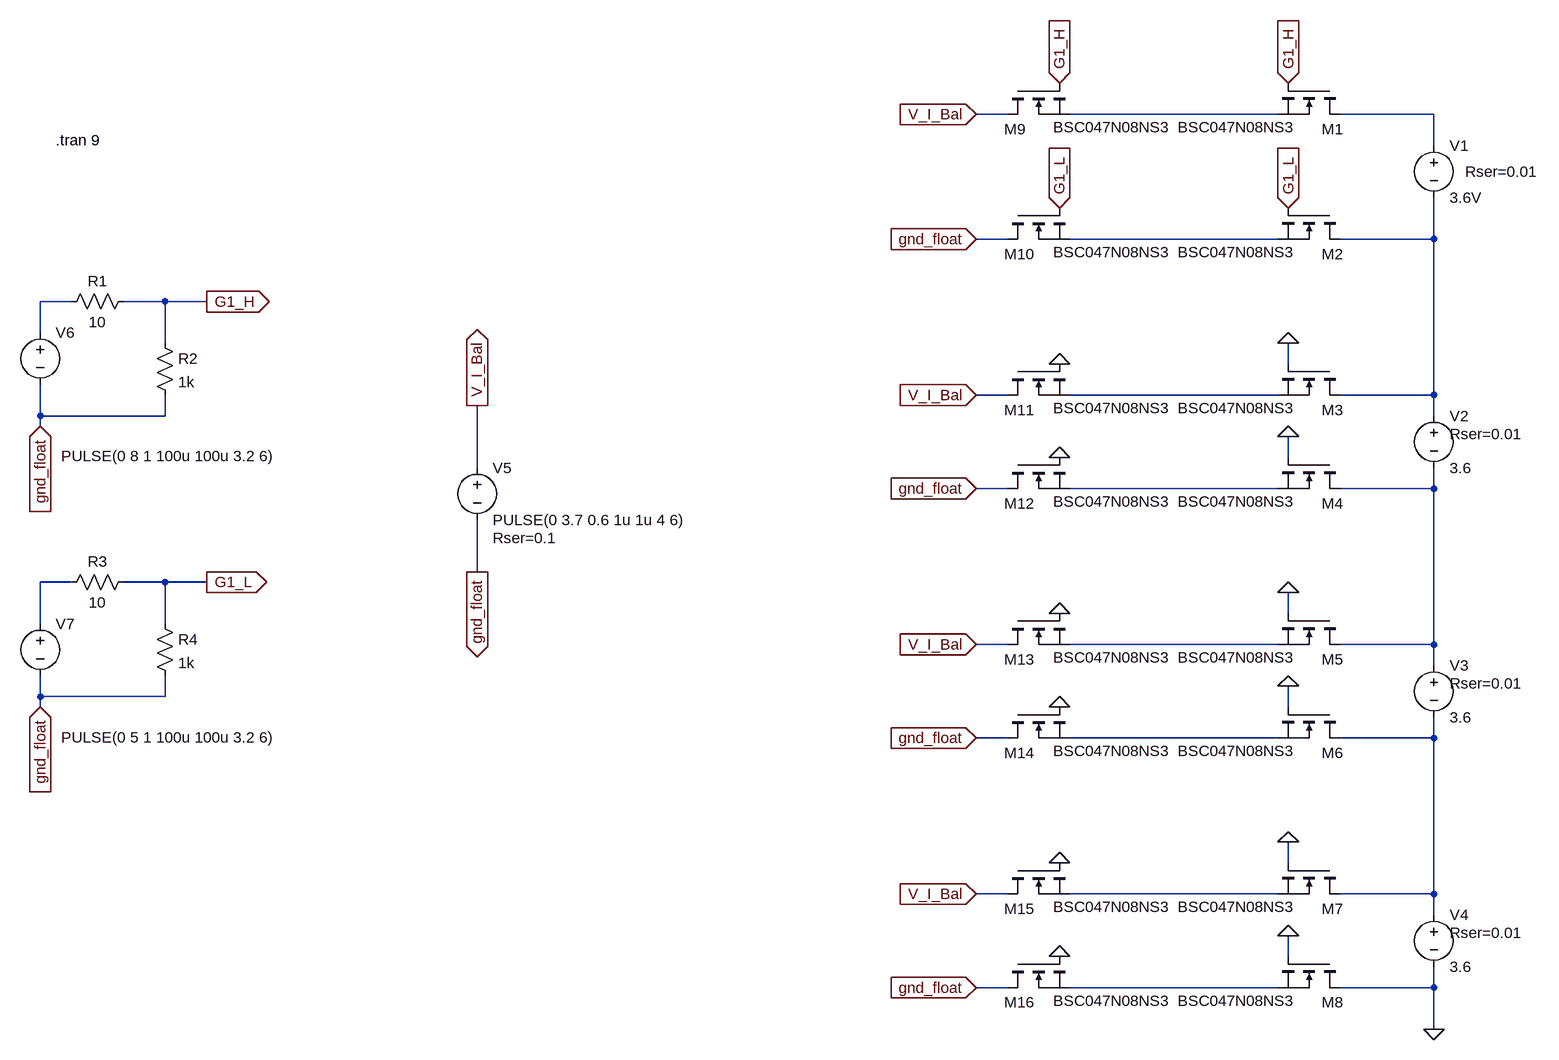
[diagram p0: schematic Simulation_Einzelmosfets.asc]
Simulation_Einzelmosfets.asc, the LTspice schematic file:
Version 4.1
SHEET 1 1152 1188
WIRE -224 -240 -272 -240
WIRE 192 -240 -128 -240
WIRE 432 -240 288 -240
WIRE 432 -192 432 -240
WIRE -224 -48 -272 -48
WIRE 192 -48 -128 -48
WIRE 432 -48 432 -112
WIRE 432 -48 288 -48
WIRE -1664 48 -1712 48
WIRE -1520 48 -1584 48
WIRE -1456 48 -1520 48
WIRE -1712 96 -1712 48
WIRE -1520 112 -1520 48
WIRE 208 144 208 112
WIRE -224 192 -272 192
WIRE 192 192 -128 192
WIRE 432 192 432 -48
WIRE 432 192 288 192
WIRE -1712 224 -1712 176
WIRE -1520 224 -1520 192
WIRE -1520 224 -1712 224
WIRE 432 224 432 192
WIRE -1712 240 -1712 224
WIRE 208 288 208 256
WIRE -1040 304 -1040 208
WIRE -224 336 -272 336
WIRE 192 336 -128 336
WIRE 432 336 432 304
WIRE 432 336 288 336
WIRE -1040 464 -1040 384
WIRE -1664 480 -1712 480
WIRE -1520 480 -1584 480
WIRE -1456 480 -1520 480
WIRE 208 528 208 496
WIRE -1712 544 -1712 480
WIRE -1520 544 -1520 480
WIRE -224 576 -272 576
WIRE 192 576 -128 576
WIRE 432 576 432 336
WIRE 432 576 288 576
WIRE 432 608 432 576
WIRE -1712 656 -1712 624
WIRE -1520 656 -1520 624
WIRE -1520 656 -1712 656
WIRE -1712 672 -1712 656
WIRE 208 672 208 640
WIRE -224 720 -272 720
WIRE 192 720 -128 720
WIRE 432 720 432 688
WIRE 432 720 288 720
WIRE 208 912 208 880
WIRE -224 960 -272 960
WIRE 192 960 -128 960
WIRE 432 960 432 720
WIRE 432 960 288 960
WIRE 432 992 432 960
WIRE 208 1056 208 1024
WIRE -224 1104 -272 1104
WIRE 192 1104 -128 1104
WIRE 432 1104 432 1072
WIRE 432 1104 288 1104
WIRE 432 1168 432 1104
FLAG 432 1168 0
FLAG -1040 208 V_I_Bal
IOPIN -1040 208 Out
FLAG -1040 464 gnd_float
IOPIN -1040 464 Out
FLAG -272 -240 V_I_Bal
IOPIN -272 -240 In
FLAG -272 -48 gnd_float
IOPIN -272 -48 In
FLAG -1456 48 G1_H
IOPIN -1456 48 Out
FLAG -1456 480 G1_L
IOPIN -1456 480 Out
FLAG 208 112 0
FLAG 208 256 0
FLAG 208 496 0
FLAG 208 640 0
FLAG 208 880 0
FLAG 208 1024 0
FLAG -144 -288 G1_H
IOPIN -144 -288 In
FLAG -144 -96 G1_L
IOPIN -144 -96 In
FLAG -144 144 0
FLAG -144 288 0
FLAG -144 528 0
FLAG -144 672 0
FLAG -144 912 0
FLAG -144 1056 0
FLAG -272 336 gnd_float
IOPIN -272 336 In
FLAG -272 720 gnd_float
IOPIN -272 720 In
FLAG -272 1104 gnd_float
IOPIN -272 1104 In
FLAG -1712 240 gnd_float
IOPIN -1712 240 In
FLAG -1712 672 gnd_float
IOPIN -1712 672 In
FLAG -272 192 V_I_Bal
IOPIN -272 192 In
FLAG -272 576 V_I_Bal
IOPIN -272 576 In
FLAG -272 960 V_I_Bal
IOPIN -272 960 In
FLAG 208 -288 G1_H
IOPIN 208 -288 In
FLAG 208 -96 G1_L
IOPIN 208 -96 In
SYMBOL nmos 288 -288 R90
WINDOW 0 71 -5 VRight 2
WINDOW 3 68 70 VRight 2
SYMATTR InstName M1
SYMATTR Value BSC047N08NS3
SYMBOL nmos 288 -96 R90
WINDOW 0 71 -5 VRight 2
WINDOW 3 68 70 VRight 2
SYMATTR InstName M2
SYMATTR Value BSC047N08NS3
SYMBOL nmos 288 144 R90
WINDOW 0 71 -5 VRight 2
WINDOW 3 68 70 VRight 2
SYMATTR InstName M3
SYMATTR Value BSC047N08NS3
SYMBOL nmos 288 288 R90
WINDOW 0 71 -5 VRight 2
WINDOW 3 68 70 VRight 2
SYMATTR InstName M4
SYMATTR Value BSC047N08NS3
SYMBOL voltage 432 -208 R0
WINDOW 123 0 0 Left 0
WINDOW 39 48 56 Left 2
SYMATTR SpiceLine Rser=0.01
SYMATTR InstName V1
SYMATTR Value 3.6V
SYMBOL voltage 432 208 R0
WINDOW 123 0 0 Left 0
WINDOW 39 24 44 Left 2
SYMATTR SpiceLine Rser=0.01
SYMATTR InstName V2
SYMATTR Value 3.6
SYMBOL nmos 288 528 R90
WINDOW 0 71 -5 VRight 2
WINDOW 3 68 70 VRight 2
SYMATTR InstName M5
SYMATTR Value BSC047N08NS3
SYMBOL nmos 288 672 R90
WINDOW 0 71 -5 VRight 2
WINDOW 3 68 70 VRight 2
SYMATTR InstName M6
SYMATTR Value BSC047N08NS3
SYMBOL voltage 432 592 R0
WINDOW 123 0 0 Left 0
WINDOW 39 24 44 Left 2
SYMATTR SpiceLine Rser=0.01
SYMATTR InstName V3
SYMATTR Value 3.6
SYMBOL nmos 288 912 R90
WINDOW 0 71 -5 VRight 2
WINDOW 3 68 70 VRight 2
SYMATTR InstName M7
SYMATTR Value BSC047N08NS3
SYMBOL nmos 288 1056 R90
WINDOW 0 71 -5 VRight 2
WINDOW 3 68 70 VRight 2
SYMATTR InstName M8
SYMATTR Value BSC047N08NS3
SYMBOL voltage 432 976 R0
WINDOW 123 0 0 Left 0
WINDOW 39 24 44 Left 2
SYMATTR SpiceLine Rser=0.01
SYMATTR InstName V4
SYMATTR Value 3.6
SYMBOL voltage -1040 288 R0
WINDOW 123 0 0 Left 0
WINDOW 39 24 124 Left 2
SYMATTR SpiceLine Rser=0.1
SYMATTR InstName V5
SYMATTR Value PULSE(0 3.7 0.6 1u 1u 4 6)
SYMBOL voltage -1712 80 R0
WINDOW 3 32 206 Left 2
WINDOW 123 0 0 Left 0
WINDOW 39 0 0 Left 0
SYMATTR Value PULSE(0 8 1 100u 100u 3.2 6)
SYMATTR InstName V6
SYMBOL res -1568 32 R90
WINDOW 0 0 56 VBottom 2
WINDOW 3 32 56 VTop 2
SYMATTR InstName R1
SYMATTR Value 10
SYMBOL res -1536 96 R0
SYMATTR InstName R2
SYMATTR Value 1k
SYMBOL voltage -1712 528 R0
WINDOW 3 32 191 Left 2
WINDOW 123 0 0 Left 0
WINDOW 39 0 0 Left 0
SYMATTR Value PULSE(0 5 1 100u 100u 3.2 6)
SYMATTR InstName V7
SYMBOL res -1568 464 R90
WINDOW 0 0 56 VBottom 2
WINDOW 3 32 56 VTop 2
SYMATTR InstName R3
SYMATTR Value 10
SYMBOL res -1536 528 R0
SYMATTR InstName R4
SYMATTR Value 1k
SYMBOL nmos -224 -288 M90
WINDOW 0 71 -5 VRight 2
WINDOW 3 68 70 VRight 2
SYMATTR InstName M9
SYMATTR Value BSC047N08NS3
SYMBOL nmos -224 -96 M90
WINDOW 0 71 -5 VRight 2
WINDOW 3 68 70 VRight 2
SYMATTR InstName M10
SYMATTR Value BSC047N08NS3
SYMBOL nmos -224 144 M90
WINDOW 0 71 -5 VRight 2
WINDOW 3 68 70 VRight 2
SYMATTR InstName M11
SYMATTR Value BSC047N08NS3
SYMBOL nmos -224 288 M90
WINDOW 0 71 -5 VRight 2
WINDOW 3 68 70 VRight 2
SYMATTR InstName M12
SYMATTR Value BSC047N08NS3
SYMBOL nmos -224 528 M90
WINDOW 0 71 -5 VRight 2
WINDOW 3 68 70 VRight 2
SYMATTR InstName M13
SYMATTR Value BSC047N08NS3
SYMBOL nmos -224 672 M90
WINDOW 0 71 -5 VRight 2
WINDOW 3 68 70 VRight 2
SYMATTR InstName M14
SYMATTR Value BSC047N08NS3
SYMBOL nmos -224 912 M90
WINDOW 0 71 -5 VRight 2
WINDOW 3 68 70 VRight 2
SYMATTR InstName M15
SYMATTR Value BSC047N08NS3
SYMBOL nmos -224 1056 M90
WINDOW 0 71 -5 VRight 2
WINDOW 3 68 70 VRight 2
SYMATTR InstName M16
SYMATTR Value BSC047N08NS3
TEXT -1688 -200 Left 2 !.tran 9

The netlist it stands for:
* Simulation_Einzelmosfets.asc
M1 N002 G1_H N001 N001 BSC047N08NS3
M2 N004 G1_L N003 N003 BSC047N08NS3
M3 N004 0 N006 N006 BSC047N08NS3
M4 N008 0 N007 N007 BSC047N08NS3
V1 N002 N004 3.6V Rser=0.01
V2 N004 N008 3.6 Rser=0.01
M5 N008 0 N010 N010 BSC047N08NS3
M6 N012 0 N011 N011 BSC047N08NS3
V3 N008 N012 3.6 Rser=0.01
M7 N012 0 N013 N013 BSC047N08NS3
M8 0 0 N014 N014 BSC047N08NS3
V4 N012 0 3.6 Rser=0.01
V5 V_I_Bal gnd_float PULSE(0 3.7 0.6 1u 1u 4 6) Rser=0.1
V6 N005 gnd_float PULSE(0 8 1 100u 100u 3.2 6)
R1 G1_H N005 10
R2 G1_H gnd_float 1k
V7 N009 gnd_float PULSE(0 5 1 100u 100u 3.2 6)
R3 G1_L N009 10
R4 G1_L gnd_float 1k
M9 V_I_Bal G1_H N001 N001 BSC047N08NS3
M10 gnd_float G1_L N003 N003 BSC047N08NS3
M11 V_I_Bal 0 N006 N006 BSC047N08NS3
M12 gnd_float 0 N007 N007 BSC047N08NS3
M13 V_I_Bal 0 N010 N010 BSC047N08NS3
M14 gnd_float 0 N011 N011 BSC047N08NS3
M15 V_I_Bal 0 N013 N013 BSC047N08NS3
M16 gnd_float 0 N014 N014 BSC047N08NS3
.model NMOS NMOS
.model PMOS PMOS
.lib standard.mos
.tran 9
.backanno
.end